# Altium schematic sheet QuardnoShield_0_1.SchDoc
size A4
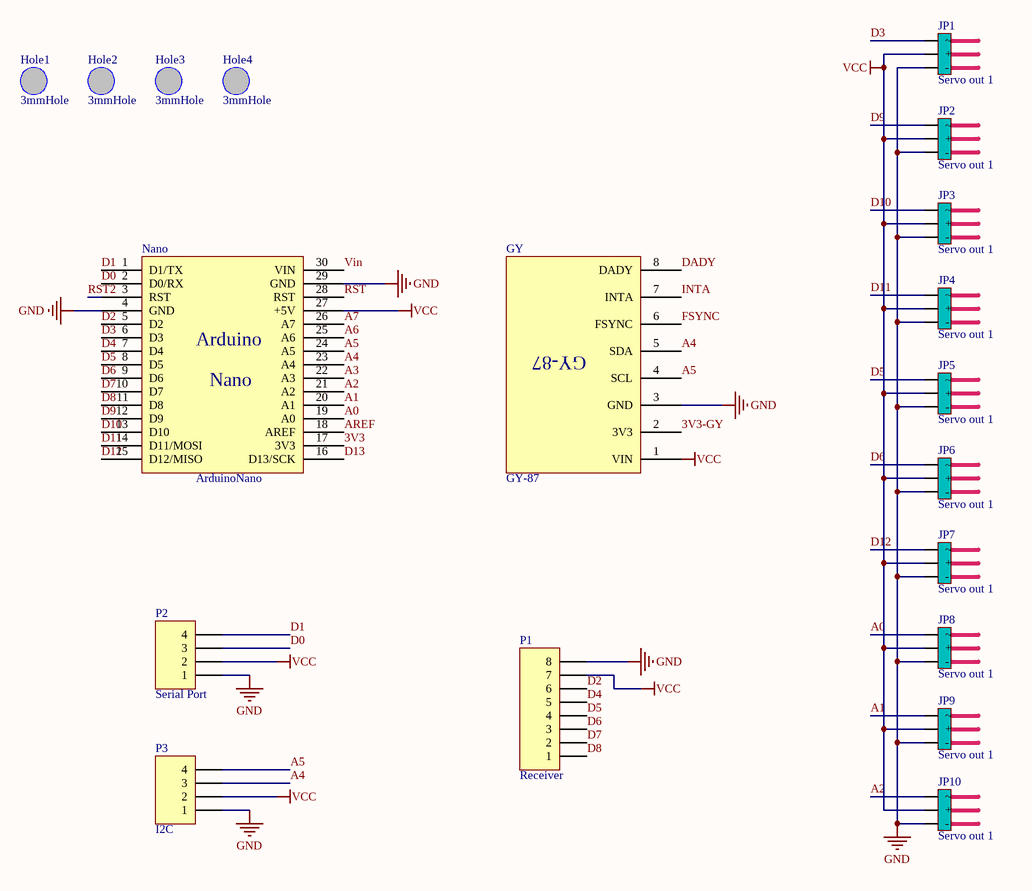
[diagram p0: QuardnoShield_0_1.SchDoc]

## Parts
GY  GY-87  [GY-87]
Hole1  3mmHole  [3mmHoleSmall]
Hole2  3mmHole  [3mmHoleSmall]
Hole3  3mmHole  [3mmHoleSmall]
Hole4  3mmHole  [3mmHoleSmall]
JP1  Servo out 1  [JP]
JP2  Servo out 1  [JP]
JP3  Servo out 1  [JP]
JP4  Servo out 1  [JP]
JP5  Servo out 1  [JP]
JP6  Servo out 1  [JP]
JP7  Servo out 1  [JP]
JP8  Servo out 1  [JP]
JP9  Servo out 1  [JP]
JP10  Servo out 1  [JP]
Nano  ArduinoNano  [NanoBase]
P1  Receiver  [HDR1X8]
P2  Serial Port  [HDR1X4]
P3  I2C  [HDR1X4]

## Nets
GND: GY.3(GND) JP1.3(-) JP2.3(-) JP3.3(-) JP4.3(-) JP5.3(-) JP6.3(-) JP7.3(-) JP8.3(-) JP9.3(-) JP10.3(-) Nano.4(GND) Nano.29(GND) P1.8 P2.1 P3.1
VCC: GY.1(VIN) JP1.2(+) JP2.2(+) JP3.2(+) JP4.2(+) JP5.2(+) JP6.2(+) JP7.2(+) JP8.2(+) JP9.2(+) JP10.2(+) Nano.27(+5V) P1.7 P2.2 P3.2
3V3: Nano.17(3V3)
3V3-GY: GY.2(3V3)
A0: JP8.1 Nano.19(A0)
A1: JP9.1 Nano.20(A1)
A2: JP10.1 Nano.21(A2)
A3: Nano.22(A3)
A4: GY.5(SDA) Nano.23(A4) P3.3
A5: GY.4(SCL) Nano.24(A5) P3.4
A6: Nano.25(A6)
A7: Nano.26(A7)
AREF: Nano.18(AREF)
D0: Nano.2(D0/RX) P2.3
D1: Nano.1(D1/TX) P2.4
D2: Nano.5(D2) P1.6
D3: JP1.1 Nano.6(D3)
D4: Nano.7(D4) P1.5
D5: JP5.1 Nano.8(D5) P1.4
D6: JP6.1 Nano.9(D6) P1.3
D7: Nano.10(D7) P1.2
D8: Nano.11(D8) P1.1
D9: JP2.1 Nano.12(D9)
D10: JP3.1 Nano.13(D10)
D11: JP4.1 Nano.14(D11/MOSI)
D12: JP7.1 Nano.15(D12/MISO)
D13: Nano.16(D13/SCK)
DADY: GY.8(DADY)
FSYNC: GY.6(FSYNC)
INTA: GY.7(INTA)
RST: Nano.28(RST)
RST2: Nano.3(RST)
Vin: Nano.30(VIN)

## Notes on the sheet
- (in symbol ArduinoNano) Arduino

## Library data of the parts
JP1-JP10 = Hdr 3 Pin 0.1: Header, 3-Pin, 0.1"; Manufacturer: Generic Components; Class: Connector; Supplier 1: Digi-Key; Supplier Part Number 1: MTLW-103-23-S-S-260-ND
P1 = Header 8: Header, 8-Pin; LatestRevisionDate: 17-Jul-2002; LatestRevisionNote: Re-released for DXP Platform.; Publisher: Altium Limited
P2 P3 = Header 4: Header, 4-Pin; LatestRevisionDate: 17-Jul-2002; LatestRevisionNote: Re-released for DXP Platform.; Publisher: Altium Limited